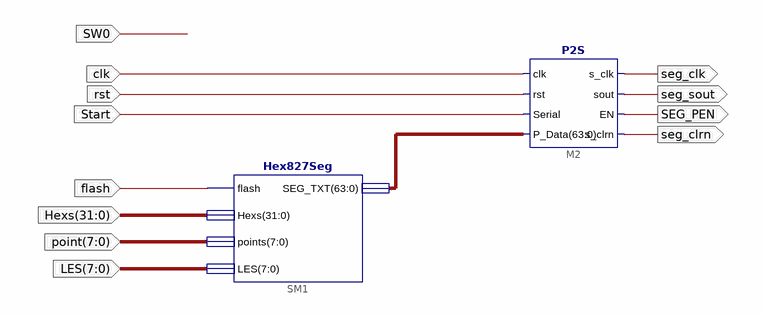
[diagram p0: schematic sheet 1]
// Xilinx ISE schematic Hex827Seg_sch.sch (kintex7) as structural Verilog: 2 symbols, 12 ports
module Hex827Seg_sch (
  input  flash,
  input  [31:0] Hexs,
  input  [7:0] point,
  input  [7:0] LES,
  input  Start,
  input  rst,
  input  clk,
  input  SW0,
  output seg_clk,
  output seg_sout,
  output SEG_PEN,
  output seg_clrn
);

  wire [63:0] XLXN_5;

  Hex827Seg SM1 (.flash(flash), .Hexs(Hexs), .points(point), .LES(LES), .SEG_TXT(XLXN_5));
  P2S M2 (
    .s_clrn(seg_clrn), .sout(seg_sout), .rst(rst), .EN(SEG_PEN), .Serial(Start), .clk(clk), .s_clk(seg_clk),
    .P_Data(XLXN_5));
endmodule
